# Altium schematic sheet Main.SchDoc
size 190 x 88 mm
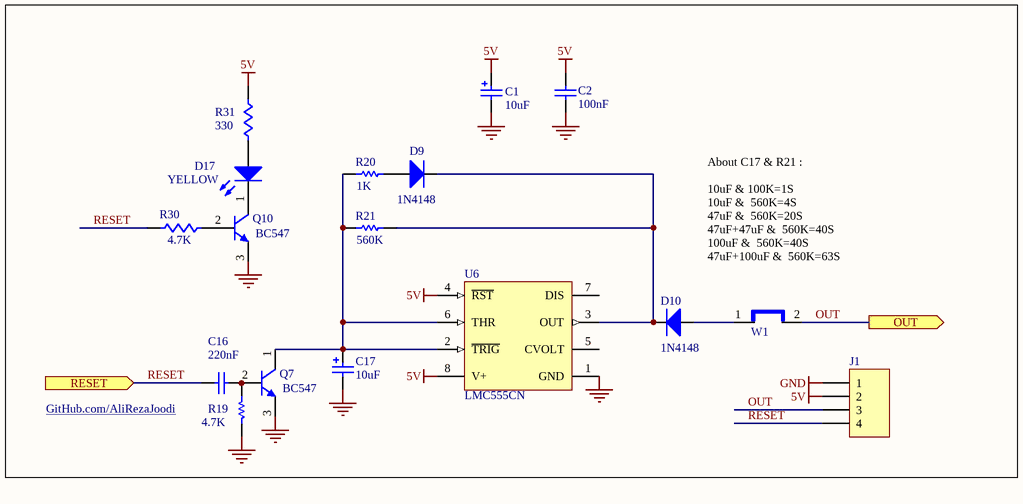
[diagram p0: Main.SchDoc]

## Parts
C1  10uF  [CAPPR2.5-6.3x5]
C2  100nF  [CAPNTO2.54-3.56x2.03]
C16  220nF  [CAPNTO5.08-7.37x3.94]
C17  10uF  [CAPPR2.5-6.3x5]
D9  1N4148  [DIODE0.4_Glass]
D10  1N4148  [DIODE0.4_Glass]
D17  YELLOW  [LED-5mm_Red]
J1  4PIN  [HDR1X4]  (value not drawn)
Q7  BC547  [TO92C]
Q10  BC547  [TO92C]
R19  4.7K  [AXIAL-0.4]
R20  1K  [AXIAL-0.4]
R21  560K  [AXIAL-0.4]
R30  4.7K  [AXIAL-0.4]
R31  330  [AXIAL-0.4]
U6  LMC555CN  [N08E]
W1  Jumper  [PIN2]  (value not drawn)

## Ports
OUT (out), RESET (in)

## Nets
5V: C1.1 C2.2 J1.2 R31.1 U6.4(~{RST}) U6.8(V+)
GND: C1.2 C2.1 C17.2 J1.1 Q7.3(E) Q10.3(E) R19.2 U6.1(GND)
OUT: J1.3 W1.2 ; port OUT
RESET: C16.1 J1.4 R30.1 ; port RESET
NetC16_2: C16.2 Q7.2(B) R19.1
NetC17_1: C17.1 Q7.1(C) R20.1 R21.1 U6.2(~{TRIG}) U6.6(THR)
NetD9_1: D9.1(A) R20.2
NetD9_2: D9.2(K) D10.2(K) R21.2 U6.3(OUT)
NetD10_1: D10.1(A) W1.1
NetD17_1: D17.1(A) R31.2
NetD17_2: D17.2(K) Q10.1(C)
NetQ10_2: Q10.2(B) R30.2

Not connected (* = marked no-connect by the designer): U6 5(CVOLT) 7(DIS)

## Notes on the sheet
- About C17 & R21 :
  10uF & 100K=1S
  10uF &  560K=4S
  47uF &  560K=20S
  47uF+47uF &  560K=40S
  100uF &  560K=40S
  47uF+100uF &  560K=63S
- GitHub.com/AliRezaJoodi

## Library data of the parts
C1 C17 = Cap Pol1: Polarized Capacitor (Radial); Manufacturer: Generic Components; Class I: Passive; Published: 8-Jun-2000; Revision: July-2002: Re-released for DXP Platform.; Publisher: Altium Limited; Class II: Capacitor
C2 C16 = Cap: Capacitor; Published: 8-Jun-2000; LatestRevisionDate: 17-Jul-2002; LatestRevisionNote: Re-released for DXP Platform.; PackageReference: RAD-0.3; Publisher: Altium Limited
D9 D10 = Diode: Default Diode; Manufacturer: Generic Components; Class I: Discrete; Class II: Diode - Switching; Published: 8-Jun-2000; Revision: July-2002: Re-released for DXP Platform.; Publisher: Altium Limited
D17 = LED: Typical INFRARED GaAs LED; Manufacturer: Generic Components; Class I: Optoelectronic; Published: 8-Jun-2000; Revision: July-2002: Re-released for DXP Platform.; Publisher: Altium Limited; Class II: LED
J1 = Header 4: Header, 4-Pin; Manufacturer: Generic Components; Class I: Connector; Revision: July-2002: Re-released for DXP Platform.; Publisher: Altium Limited
Q7 Q10 = NPN: NPN Bipolar Transistor; Manufacturer: Generic Components; Class I: Discrete; Class II: BJT - Low Power; Published: 8-Jun-2000; Revision: July-2002: Re-released for DXP Platform.; Publisher: Altium Limited
R19-R21 = Res1: Resistor; Published: 8-Jun-2000; LatestRevisionDate: 17-Jul-2002; LatestRevisionNote: Re-released for DXP Platform.; PackageReference: AXIAL-0.3; Publisher: Altium Limited
R30 R31 = Res1: Resistor; Manufacturer: Generic Components; Class I: Passive; Published: 8-Jun-2000; Revision: July-2002: Re-released for DXP Platform.; Publisher: Altium Limited; Class II: Resistor
U6 = LMC555CN: CMOS Timer, 8-pin MDIP; Manufacturer: National Semiconductor; PackageTopMarking: NSUZXYTTE#*LMC*555CN; PowerWise: N; CompType: Analog IC; Published: 4-Dec-2008; DatasheetVersion: May-2006; PackageVersion: revG, May-2006; PackageReference: N08E; Publisher: Altium Limited; PackageDescription: MDIP, .365 x .250 x .130in, 8 Lead, .100in Pitch; Supplier 1: Farnell; Supplier Part Number 1: 9488243; PartNumber: LMC555CN; RoHS: N; PinCount: 8; Code_JEDEC: MS-001-BA; ComponentLink1Description: LMC555 Datasheet; ComponentLink1URL: http://www.national.com/ds/LM/LMC555.pdf; ComponentLink2Description: LMC555 Web Page; ComponentLink2URL: http://www.national.com/pf/LM/LMC555.html; ComponentLink3Description: N08E Package Page; ComponentLink3URL: http://www.national.com/packaging/folders/n08e.html
W1 = Jumper 2pin_2: Jumper Wire; Manufacturer: Generic Components; Published: 24-Mar-1999; Revision: July-2002: Re-released for DXP Platform.; Publisher: Altium Limited